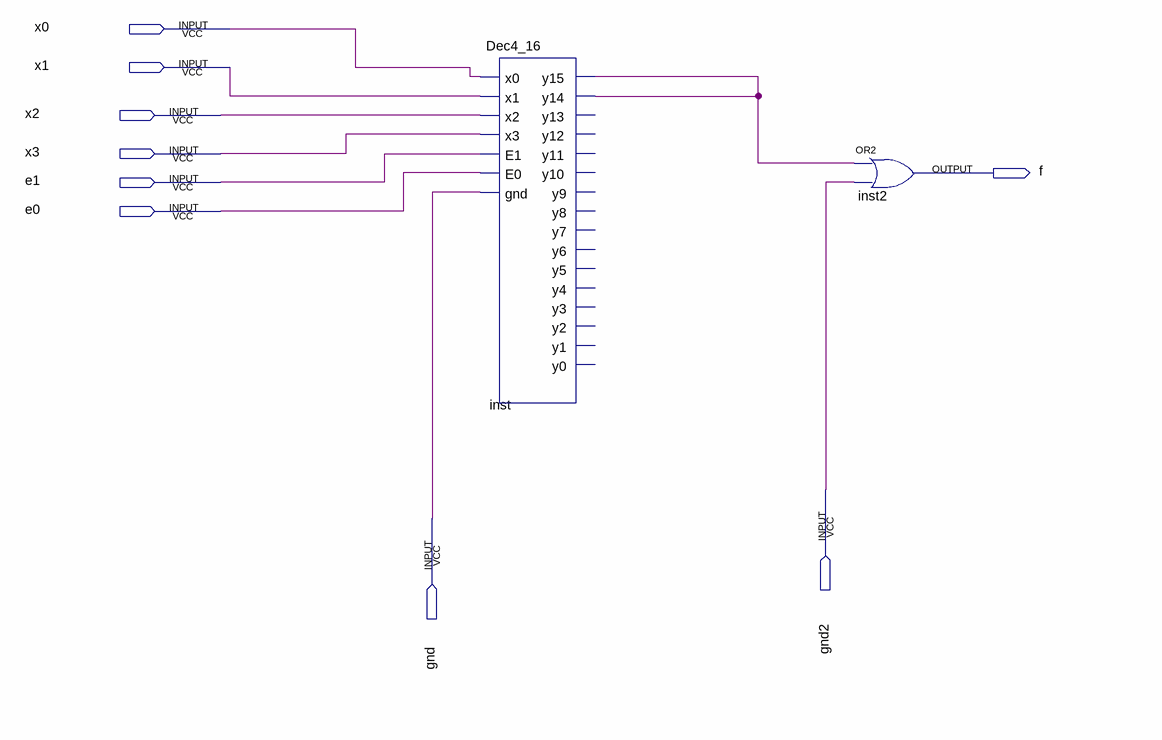
[diagram p0: schematic sheet]
// Quartus schematic DecoderDemo3.bdf as structural Verilog: 2 symbols, 9 pins
module DecoderDemo3 (
  input  x0,
  input  x1,
  input  x2,
  input  x3,
  input  e1,
  input  e0,
  input  gnd2,
  input  gnd,
  output f
);

  wire inst_y15;

  Dec4_16 inst (
    .x0(x0), .x1(x1), .x2(x2), .x3(x3), .E1(e1), .E0(e0), .gnd(gnd), .y15(inst_y15), .y14(inst_y15));  // open: y13, y12, y11, y10, y9, y8, y7, y6, y5, y4, y3, y2, y1, y0
  or inst2 (f, inst_y15, gnd2);
endmodule
